# Altium schematic sheet PowerSupport.SchDoc
size A3
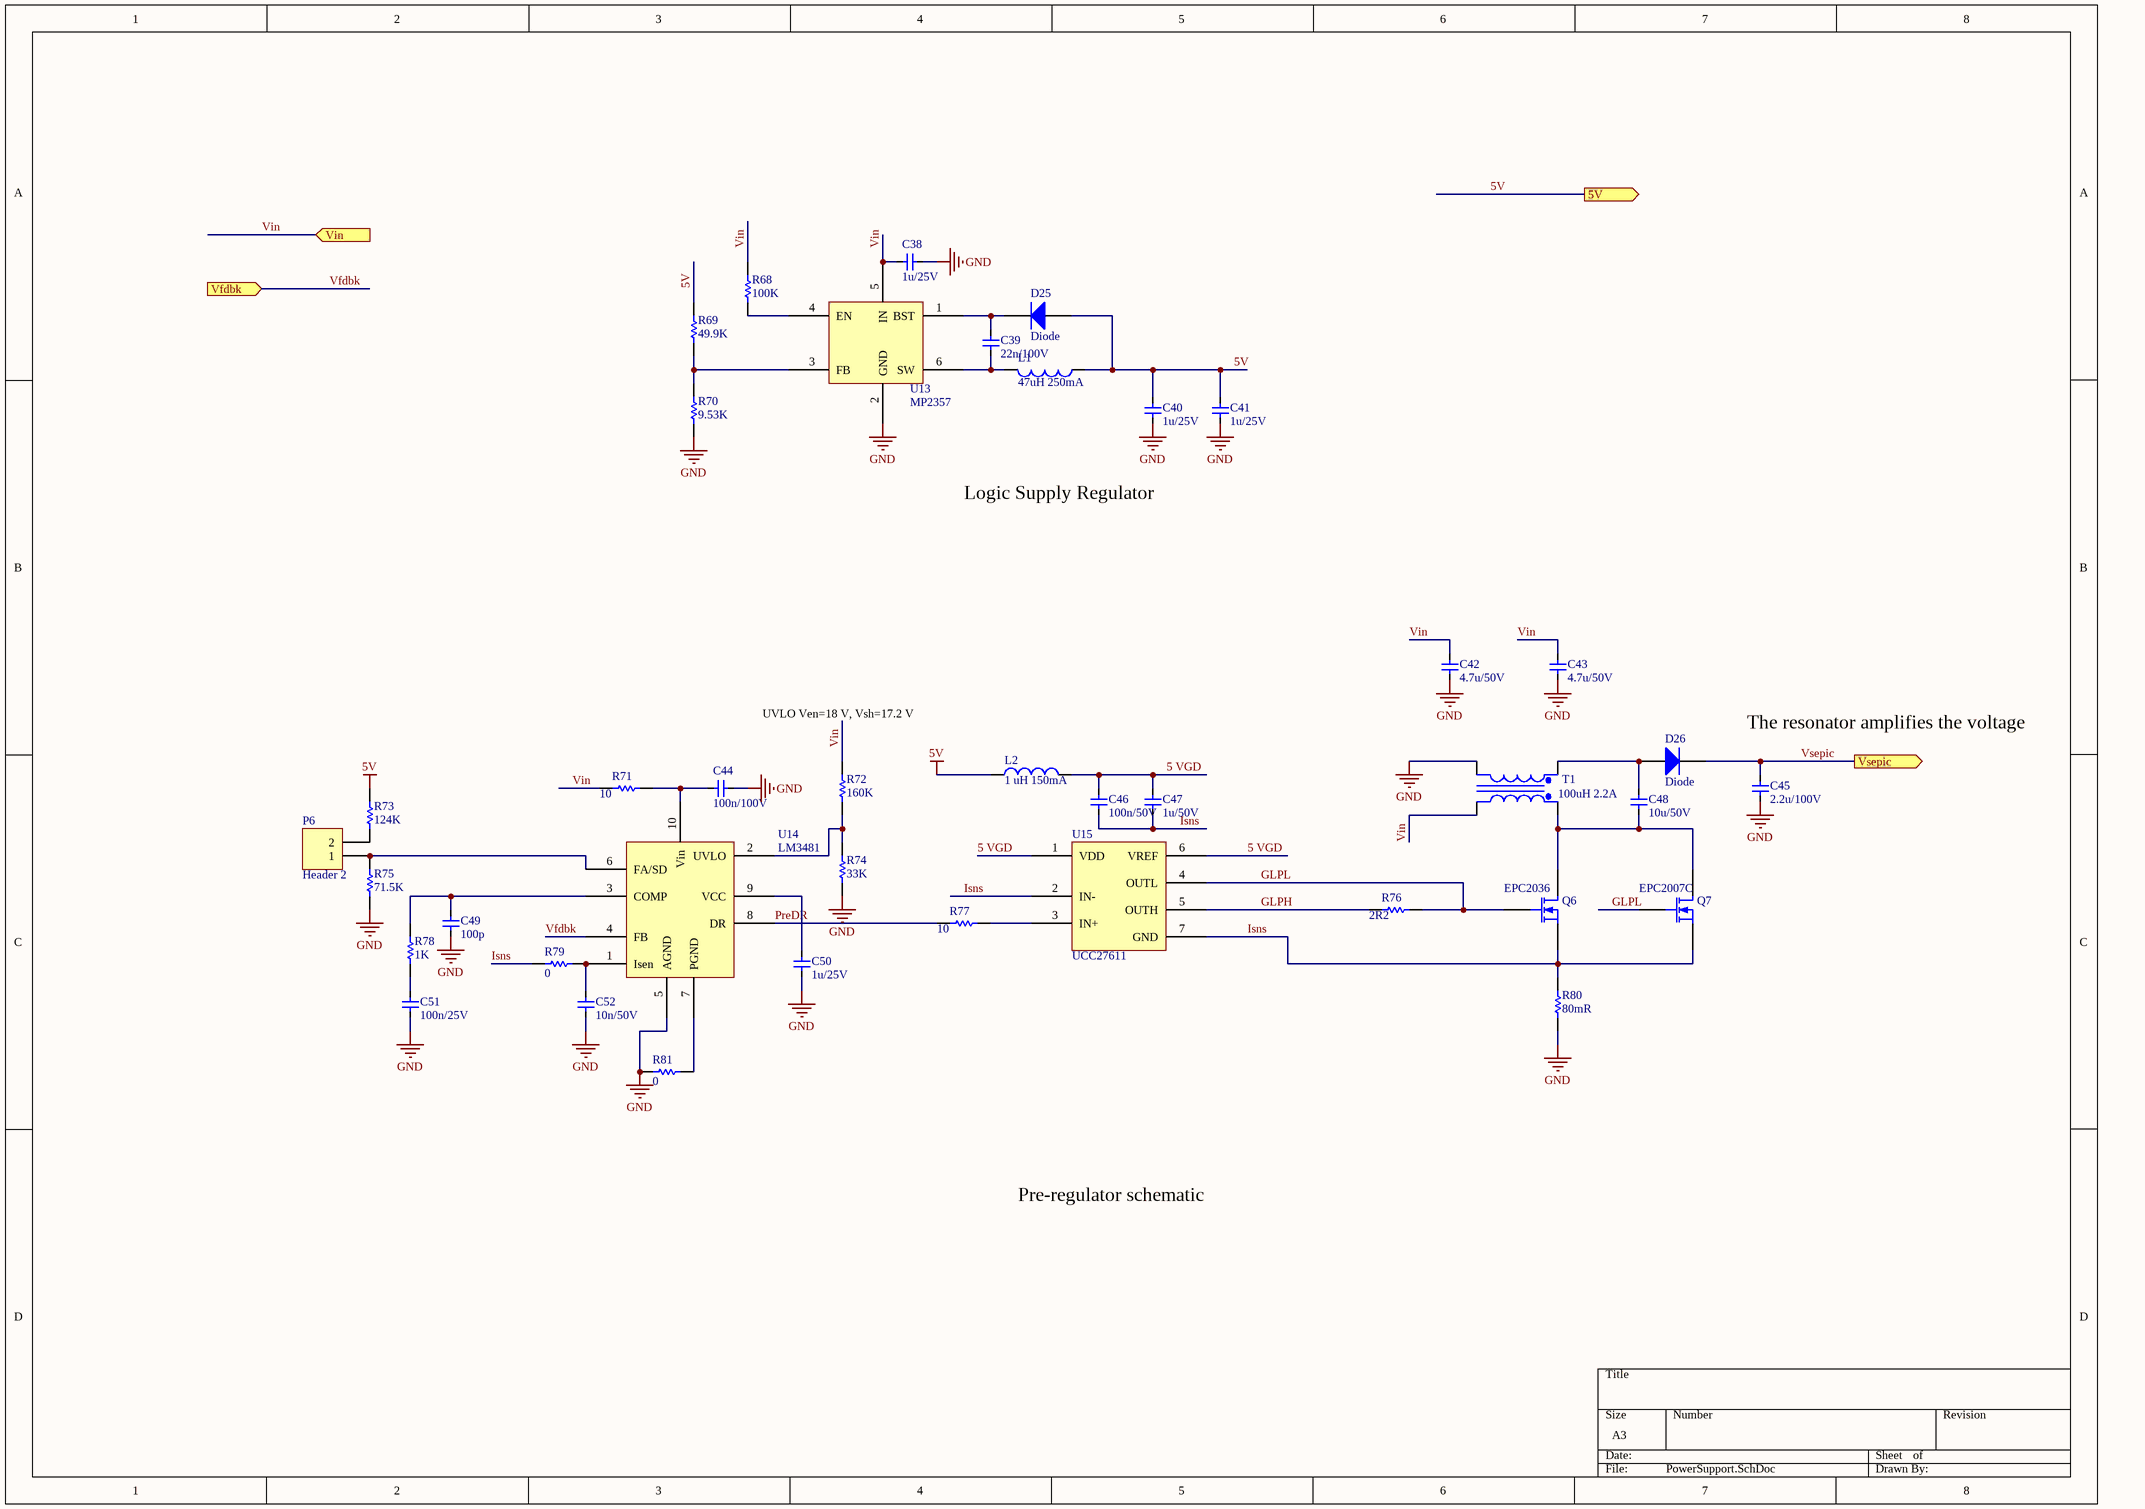
[diagram p0: PowerSupport.SchDoc]

## Parts
C38  1u/25V  [0603]
C39  22n/100V  [0603]
C40  1u/25V  [0603]
C41  1u/25V  [0603]
C42  4.7u/50V  [0603]
C43  4.7u/50V  [0603]
C44  100n/100V  [0603]
C45  2.2u/100V  [0603]
C46  100n/50V  [0603]
C47  1u/50V  [0603]
C48  10u/50V  [0603]
C49  100p  [0603]
C50  1u/25V  [0603]
C51  100n/25V  [0603]
C52  10n/50V  [0603]
D25  Diode  [SMA]
D26  Diode  [SMA]
L1  value 47uH 250mA  [0402-A]  (hidden comment: Inductor)
L2  value 1 uH 150mA  [0402-A]  (hidden comment: Inductor)
P6  Header 2  [HDR1X2]
Q6  EPC2036  [BGA100P9X9-81A]
Q7  EPC2007C  [BGA100P9X9-81A]
R68  value 100K  [0603]  (hidden comment: Res1)
R69  value 49.9K  [0603]  (hidden comment: Res1)
R70  value 9.53K  [0603]  (hidden comment: Res1)
R71  value 10  [0603]  (hidden comment: Res1)
R72  value 160K  [0603]  (hidden comment: Res1)
R73  value 124K  [0603]  (hidden comment: Res1)
R74  value 33K  [0603]  (hidden comment: Res1)
R75  value 71.5K  [0603]  (hidden comment: Res1)
R76  value 2R2  [0603]  (hidden comment: Res1)
R77  value 10  [0603]  (hidden comment: Res1)
R78  value 1K  [0603]  (hidden comment: Res1)
R79  value 0  [0603]  (hidden comment: Res1)
R80  value 80mR  [0603]  (hidden comment: Res1)
R81  value 0  [0603]  (hidden comment: Res1)
T1  value 100uH 2.2A  [SOT830P245X1500-5N]  (hidden comment: Trans Cupl)
U13  MP2357  [SOT95P280X100-6N]
U14  LM3481  [TSSOP50P500X100-10N]
U15  UCC27611  [QFN65P250X200X80-6N]

## Ports
5V (out), Vfdbk (in), Vin (in), Vsepic (out)

## Nets
5V: C40.2 C41.2 D25.1(A) L1.1 L2.1 R69.1 R73.1 ; port 5V
GND: C38.2 C40.1 C41.1 C42.1 C43.1 C44.1 C45.1 C49.1 C50.2 C51.1 C52.1 R70.2 R74.1 R75.2 R80.1 R81.2 T1.2(Pri-) U13.2(GND) U14.5(AGND)
5 VGD: C46.2 C47.2 L2.2 U15.1(VDD) U15.6(VREF)
GLPH: R76.1 U15.5(OUTH)
GLPL: Q6.2(G) Q7.2(G) R76.2 U15.4(OUTL)
Isns: C46.1 C47.1 Q6.3(S) Q7.3(S) R79.2 R80.2 U15.2(IN-) U15.7(GND)
PreDR: R77.1 U14.8(DR)
Vfdbk: U14.4(FB) ; port Vfdbk
Vin: C38.1 C42.2 C43.2 R68.1 R71.1 R72.2 T1.4(Sec-) U13.5(IN) ; port Vin
Vsepic: C45.2 D26.2(K) ; port Vsepic
NetC39_1: C39.1 L1.2 U13.6(SW)
NetC39_2: C39.2 D25.2(K) U13.1(BST)
NetC44_2: C44.2 R71.2 U14.10(Vin)
NetC48_1: C48.1 Q6.1(D) Q7.1(D) T1.3(Sec+)
NetC48_2: C48.2 D26.1(A) T1.1(Pri+)
NetC49_2: C49.2 R78.2 U14.3(COMP)
NetC50_1: C50.1 U14.9(VCC)
NetC51_2: C51.2 R78.1
NetC52_2: C52.2 R79.1 U14.1(Isen)
NetP6_1: P6.1 R75.1 U14.6(FA/SD)
NetP6_2: P6.2 R73.2
NetR68_2: R68.2 U13.4(EN)
NetR69_2: R69.2 R70.1 U13.3(FB)
NetR72_1: R72.1 R74.2 U14.2(UVLO)
NetR77_2: R77.2 U15.3(IN+)
NetR81_1: R81.1 U14.7(PGND)

## Notes on the sheet
- Logic Supply Regulator
- UVLO Ven=18 V, Vsh=17.2 V
- The resonator amplifies the voltage
- Pre-regulator schematic

## Library data of the parts
C38-C52 = CAP1: Capacitor
D25 D26 = Diode: Default Diode; Published: 8-Jun-2000; LatestRevisionDate: 17-Jul-2002; LatestRevisionNote: Re-released for DXP Platform.; PackageVersion: Sep-1996; PackageReference: SMC; Publisher: Altium Limited; PackageDescription: DO-214-AB/SMC; 2 C-Bend Leads; Body 7.9 x 5.9 mm, inc. leads (LxW); Code_JEDEC: DO-214-AB
L1 L2 = Inductor: Code_IEC: 1005; Published: 8-Jun-2000; LatestRevisionDate: 29-May-2009; LatestRevisionNote: IPC-7351 Footprint Added.; PackageReference: 0402-A; Publisher: Altium Limited; PackageDescription: Chip Inductor; Code_JEITA: 0402
P6 = Header 2: Header, 2-Pin; LatestRevisionDate: 17-Jul-2002; LatestRevisionNote: Re-released for DXP Platform.; Publisher: Altium Limited
Q6 Q7 = MOSFET-N: N-Channel MOSFET; Published: 8-Jun-2000; LatestRevisionDate: 17-Jul-2002; LatestRevisionNote: Re-released for DXP Platform.; PackageVersion: 1995/1996; PackageReference: E3; Publisher: Altium Limited; PackageDescription: TO, Flat Index; 3 In-Line, Axial Leads; Body Dia. 4.6mm; Lead Dia. 0.5 mm (max)
R68-R81 = Res1: Resistor; Published: 8-Jun-2000; LatestRevisionDate: 17-Jul-2002; LatestRevisionNote: Re-released for DXP Platform.; PackageReference: AXIAL-0.3; Publisher: Altium Limited; PackageDescription: Axial Device, Thru-Hole; 2 Leads; 0.3 in Pin Spacing
T1 = Trans Cupl: Transformer (Coupled Inductor Model); Published: 8-Jun-2000; LatestRevisionDate: 17-Jul-2002; LatestRevisionNote: Re-released for DXP Platform.; PackageReference: TRF_4; Publisher: Altium Limited; PackageDescription: Transformer; 4 Leads